# Altium schematic sheet BV100011_ControlTopLevel.SchDoc
size B
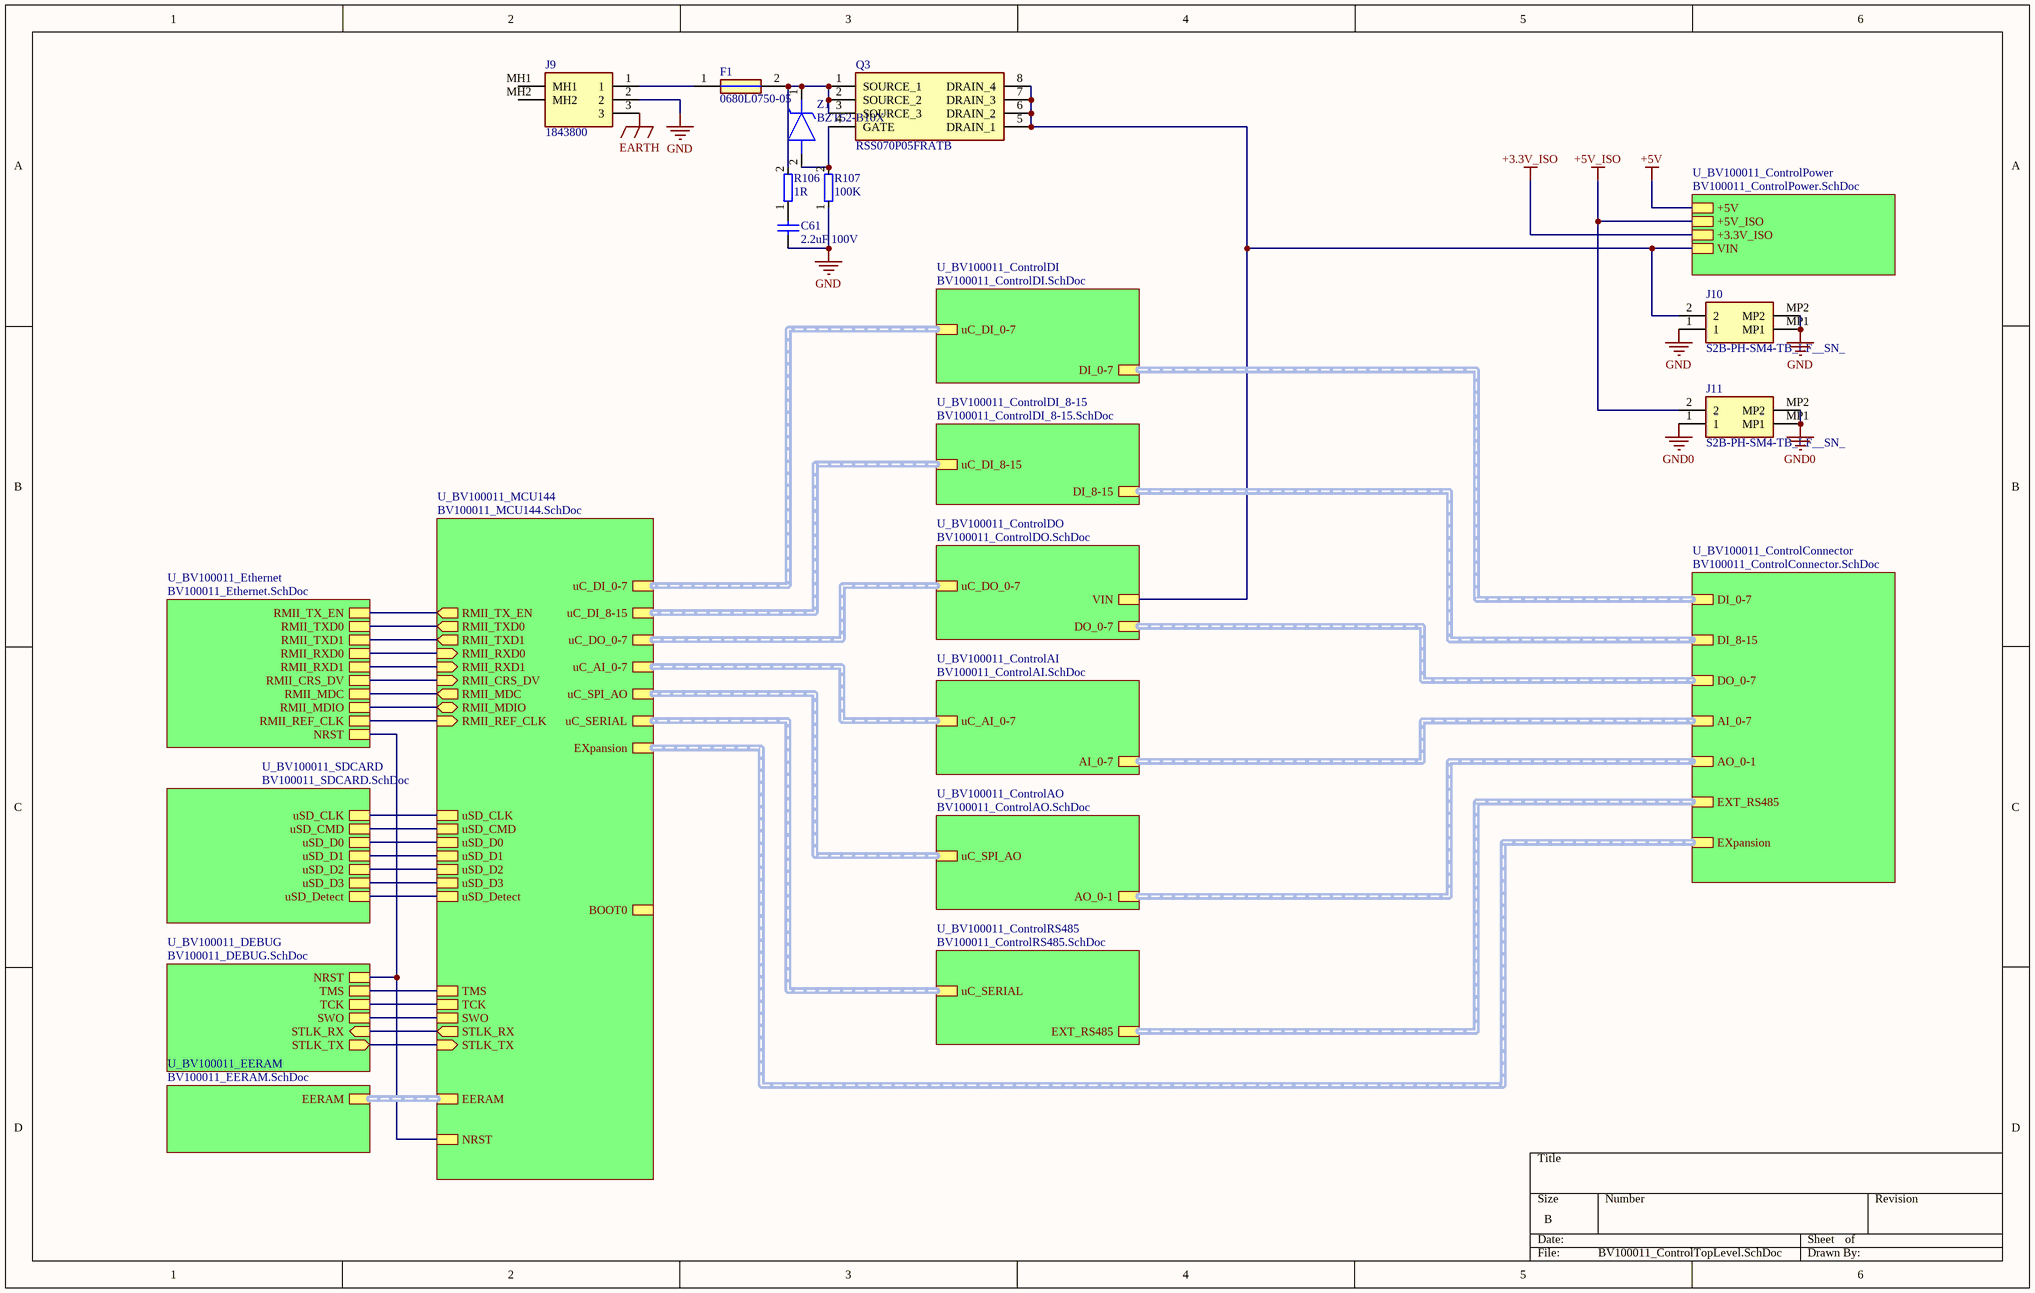
[diagram p0: BV100011_ControlTopLevel.SchDoc]

## Parts
C61  2.2uF 100V  [C1210]
F1  0680L0750-05  [FUSC6125X279N]
J9  1843800  [1843800]
J10  S2B-PH-SM4-TB_LF__SN_  [S2BPHSM4TBLFSN]
J11  S2B-PH-SM4-TB_LF__SN_  [S2BPHSM4TBLFSN]
Q3  RSS070P05FRATB  [SOIC127P600X175-8N]
R106  1R  [R0805]
R107  100K  [R0603]
Z1  BZT52-B10X  [SODFL3616X130N]

## Sub-sheets
U_BV100011_ControlAI = BV100011_ControlAI.SchDoc: uC_AI_0-7 (harness uC_AI_0-7), AI_0-7 (harness AI_0-7)
U_BV100011_ControlAO = BV100011_ControlAO.SchDoc: AO_0-1 (harness AO_0-1), uC_SPI_AO (harness uC_SPI_AO)
U_BV100011_ControlConnector = BV100011_ControlConnector.SchDoc: DI_0-7 (harness DI_0-7), AI_0-7 (harness AI_0-7), DO_0-7 (harness DO_0-7), AO_0-1 (harness AO_0-1), EXT_RS485 (harness EXT_RS485), DI_8-15 (harness DI_8-15), EXpansion (harness Expansion)
U_BV100011_ControlDI = BV100011_ControlDI.SchDoc: DI_0-7 (harness DI_0-7), uC_DI_0-7 (harness uC_DI_0-7)
U_BV100011_ControlDI_8-15 = BV100011_ControlDI_8-15.SchDoc: DI_8-15 (harness DI_8-15), uC_DI_8-15 (harness uC_DI_8-15)
U_BV100011_ControlDO = BV100011_ControlDO.SchDoc: DO_0-7 (harness DO_0-7), uC_DO_0-7 (harness uC_DO_0-7), VIN
U_BV100011_ControlPower = BV100011_ControlPower.SchDoc: VIN, +5V, +5V_ISO, +3.3V_ISO
U_BV100011_ControlRS485 = BV100011_ControlRS485.SchDoc: uC_SERIAL (harness uC_SERIAL), EXT_RS485 (harness EXT_RS485)
U_BV100011_DEBUG = BV100011_DEBUG.SchDoc: TMS, TCK, SWO, NRST, STLK_RX (in), STLK_TX (out)
U_BV100011_EERAM = BV100011_EERAM.SchDoc: EERAM (harness EERAM)
U_BV100011_Ethernet = BV100011_Ethernet.SchDoc: RMII_TXD0, RMII_TX_EN, RMII_RXD0, RMII_REF_CLK, RMII_CRS_DV, RMII_MDC, RMII_MDIO, NRST, RMII_TXD1, RMII_RXD1
U_BV100011_MCU144 = BV100011_MCU144.SchDoc: NRST, TCK, TMS, SWO, BOOT0, uC_DI_0-7 (harness uC_DI_0-7), uC_DI_8-15 (harness uC_DI_8-15), uC_DO_0-7 (harness uC_DO_0-7), uC_SPI_AO (harness uC_SPI_AO), uC_SERIAL (harness uC_SERIAL), uSD_CLK, uSD_CMD, uSD_D0, uSD_D1, uSD_D2, uSD_D3, uSD_Detect, RMII_REF_CLK (in), RMII_MDIO (bidir), RMII_CRS_DV (in), RMII_RXD0 (in), RMII_MDC (out), RMII_RXD1 (in), RMII_TXD1 (out), RMII_TXD0 (out), RMII_TX_EN (out), STLK_RX (out), STLK_TX (in), uC_AI_0-7 (harness uC_AI_0-7), EERAM (harness EERAM), EXpansion (harness Expansion)
U_BV100011_SDCARD = BV100011_SDCARD.SchDoc: uSD_CLK, uSD_CMD, uSD_D0, uSD_D1, uSD_D2, uSD_D3, uSD_Detect

## Nets
+3.3V_ISO: sheet U_BV100011_ControlPower/+3.3V_ISO
+5V: sheet U_BV100011_ControlPower/+5V
+5V_ISO: J11.2 ; sheet U_BV100011_ControlPower/+5V_ISO
EARTH: J9.3
GND: C61.1 J9.2 J10.1 J10.MP1 J10.MP2 R107.1
GND0: J11.1 J11.MP1 J11.MP2
NetC61_2: C61.2 R106.1
NetF1_1: F1.1 J9.1
NetF1_2: F1.2 Q3.1(SOURCE_1) Q3.2(SOURCE_2) Q3.3(SOURCE_3) R106.2 Z1.1(K)
NetJ10_2: J10.2 Q3.5(DRAIN_1) Q3.6(DRAIN_2) Q3.7(DRAIN_3) Q3.8(DRAIN_4) ; sheet U_BV100011_ControlDO/VIN, sheet U_BV100011_ControlPower/VIN
NetQ3_4: Q3.4(GATE) R107.2 Z1.2(A)
(unnamed): sheet U_BV100011_SDCARD/uSD_CLK, sheet U_BV100011_MCU144/uSD_CLK
(unnamed): sheet U_BV100011_SDCARD/uSD_CMD, sheet U_BV100011_MCU144/uSD_CMD
(unnamed): sheet U_BV100011_SDCARD/uSD_D0, sheet U_BV100011_MCU144/uSD_D0
(unnamed): sheet U_BV100011_SDCARD/uSD_D1, sheet U_BV100011_MCU144/uSD_D1
(unnamed): sheet U_BV100011_SDCARD/uSD_D2, sheet U_BV100011_MCU144/uSD_D2
(unnamed): sheet U_BV100011_SDCARD/uSD_D3, sheet U_BV100011_MCU144/uSD_D3
(unnamed): sheet U_BV100011_SDCARD/uSD_Detect, sheet U_BV100011_MCU144/uSD_Detect
(unnamed): sheet U_BV100011_Ethernet/RMII_TXD0, sheet U_BV100011_MCU144/RMII_TXD0
(unnamed): sheet U_BV100011_Ethernet/RMII_TX_EN, sheet U_BV100011_MCU144/RMII_TX_EN
(unnamed): sheet U_BV100011_Ethernet/RMII_RXD0, sheet U_BV100011_MCU144/RMII_RXD0
(unnamed): sheet U_BV100011_Ethernet/RMII_REF_CLK, sheet U_BV100011_MCU144/RMII_REF_CLK
(unnamed): sheet U_BV100011_Ethernet/RMII_CRS_DV, sheet U_BV100011_MCU144/RMII_CRS_DV
(unnamed): sheet U_BV100011_Ethernet/RMII_MDC, sheet U_BV100011_MCU144/RMII_MDC
(unnamed): sheet U_BV100011_Ethernet/RMII_MDIO, sheet U_BV100011_MCU144/RMII_MDIO
(unnamed): sheet U_BV100011_Ethernet/NRST, sheet U_BV100011_DEBUG/NRST, sheet U_BV100011_MCU144/NRST
(unnamed): sheet U_BV100011_Ethernet/RMII_TXD1, sheet U_BV100011_MCU144/RMII_TXD1
(unnamed): sheet U_BV100011_Ethernet/RMII_RXD1, sheet U_BV100011_MCU144/RMII_RXD1
(unnamed): sheet U_BV100011_DEBUG/TMS, sheet U_BV100011_MCU144/TMS
(unnamed): sheet U_BV100011_DEBUG/TCK, sheet U_BV100011_MCU144/TCK
(unnamed): sheet U_BV100011_DEBUG/SWO, sheet U_BV100011_MCU144/SWO
(unnamed): sheet U_BV100011_DEBUG/STLK_RX, sheet U_BV100011_MCU144/STLK_RX
(unnamed): sheet U_BV100011_DEBUG/STLK_TX, sheet U_BV100011_MCU144/STLK_TX

Not connected (* = marked no-connect by the designer): J9 MH1 MH2

## Buses and harness runs
harness sheet U_BV100011_ControlAI/AI_0-7 = sheet U_BV100011_ControlConnector/AI_0-7
harness sheet U_BV100011_ControlAI/uC_AI_0-7 = sheet U_BV100011_MCU144/uC_AI_0-7
harness sheet U_BV100011_ControlAO/AO_0-1 = sheet U_BV100011_ControlConnector/AO_0-1
harness sheet U_BV100011_ControlAO/uC_SPI_AO = sheet U_BV100011_MCU144/uC_SPI_AO
harness sheet U_BV100011_ControlConnector/DI_0-7 = sheet U_BV100011_ControlDI/DI_0-7
harness sheet U_BV100011_ControlConnector/DI_8-15 = sheet U_BV100011_ControlDI_8-15/DI_8-15
harness sheet U_BV100011_ControlConnector/DO_0-7 = sheet U_BV100011_ControlDO/DO_0-7
harness sheet U_BV100011_ControlConnector/EXpansion = sheet U_BV100011_MCU144/EXpansion
harness sheet U_BV100011_ControlConnector/EXT_RS485 = sheet U_BV100011_ControlRS485/EXT_RS485
harness sheet U_BV100011_ControlDI/uC_DI_0-7 = sheet U_BV100011_MCU144/uC_DI_0-7
harness sheet U_BV100011_ControlDI_8-15/uC_DI_8-15 = sheet U_BV100011_MCU144/uC_DI_8-15
harness sheet U_BV100011_ControlDO/uC_DO_0-7 = sheet U_BV100011_MCU144/uC_DO_0-7
harness sheet U_BV100011_ControlRS485/uC_SERIAL = sheet U_BV100011_MCU144/uC_SERIAL
harness sheet U_BV100011_EERAM/EERAM = sheet U_BV100011_MCU144/EERAM

## Library data of the parts
C61 = Cap: Capacitor; Value: 0.01uF; Published: 8-Jun-2000; LatestRevisionDate: 17-Jul-2002; LatestRevisionNote: Re-released for DXP Platform.; PackageReference: RAD-0.3; Publisher: Altium Limited
F1 = 0680L0750-05: Fuse; Manufacturer_Name: Stewart Connector; Datasheet Link: https://belfuse.com/resources/datasheets/circuitprotection/ds-cp-0680l-series.pdf; Height: 2.79mm; Manufacturer_Part_Number: 0680L0750-05; Mouser Part Number: 530-0680L0750-05; Mouser Price/Stock: https://www.mouser.co.uk/ProductDetail/Bel-Fuse/0680L0750-05?qs=XeJtXLiO41Q8xKKngRilvg%3D%3D
J9 = 1843800: Connector; Manufacturer_Name: Phoenix Contact; Datasheet Link: https://www.phoenixcontact.com/online/portal/gb?uri=pxc-oc-itemdetail:pid=1843800&library=gben&tab=1; Height: 7.4mm; Manufacturer_Part_Number: 1843800; Arrow Part Number: 1843800; Arrow Price/Stock: https://www.arrow.com/en/products/1843800/phoenix-contact; Mouser Part Number: 651-1843800; Mouser Price/Stock: https://www.mouser.co.uk/ProductDetail/Phoenix-Contact/1843800?qs=uJX40y%252BSWqgV2WPXXVa%2FDw%3D%3D
J10 J11 = S2B-PH-SM4-TB_LF__SN_: Connector; Manufacturer_Name: JST Sales America; Manufacturer_Part_Number: S2B-PH-SM4-TB(LF)(SN); Datasheet Link: https://www.jst-mfg.com/product/pdf/eng/ePH.pdf; Height: 6.6mm
Q3 = RSS070P05FRATB: MOSFET (P-Channel); Manufacturer_Name: ROHM Semiconductor; Datasheet Link: https://d1d2qsbl8m0m72.cloudfront.net/en/products/databook/datasheet/discrete/transistor/mosfet/rss070p05fra-e.pdf; Height: 1.75mm; Manufacturer_Part_Number: RSS070P05FRATB; Mouser Part Number: 755-RSS070P05FRATB; Mouser Price/Stock: https://www.mouser.com/Search/Refine.aspx?Keyword=755-RSS070P05FRATB
R106 R107 = µç×è£¨1£©: Resistor
Z1 = BZT52-B10X: Zener Diode; Manufacturer_Name: Nexperia; Datasheet Link: https://componentsearchengine.com/Datasheets/2/BZT52-B10X.pdf; Height: 1.3mm; Manufacturer_Part_Number: BZT52-B10X; Arrow Part Number: BZT52-B10X; Arrow Price/Stock: https://www.arrow.com/en/products/bzt52-b10x/nexperia; Mouser Part Number: 771-BZT52-B10X; Mouser Price/Stock: https://www.mouser.co.uk/ProductDetail/Nexperia/BZT52-B10X?qs=W0yvOO0ixfEZrHW2hWNc1Q%3D%3D